# EAGLE design Framework (EAGLE 7.2.0)
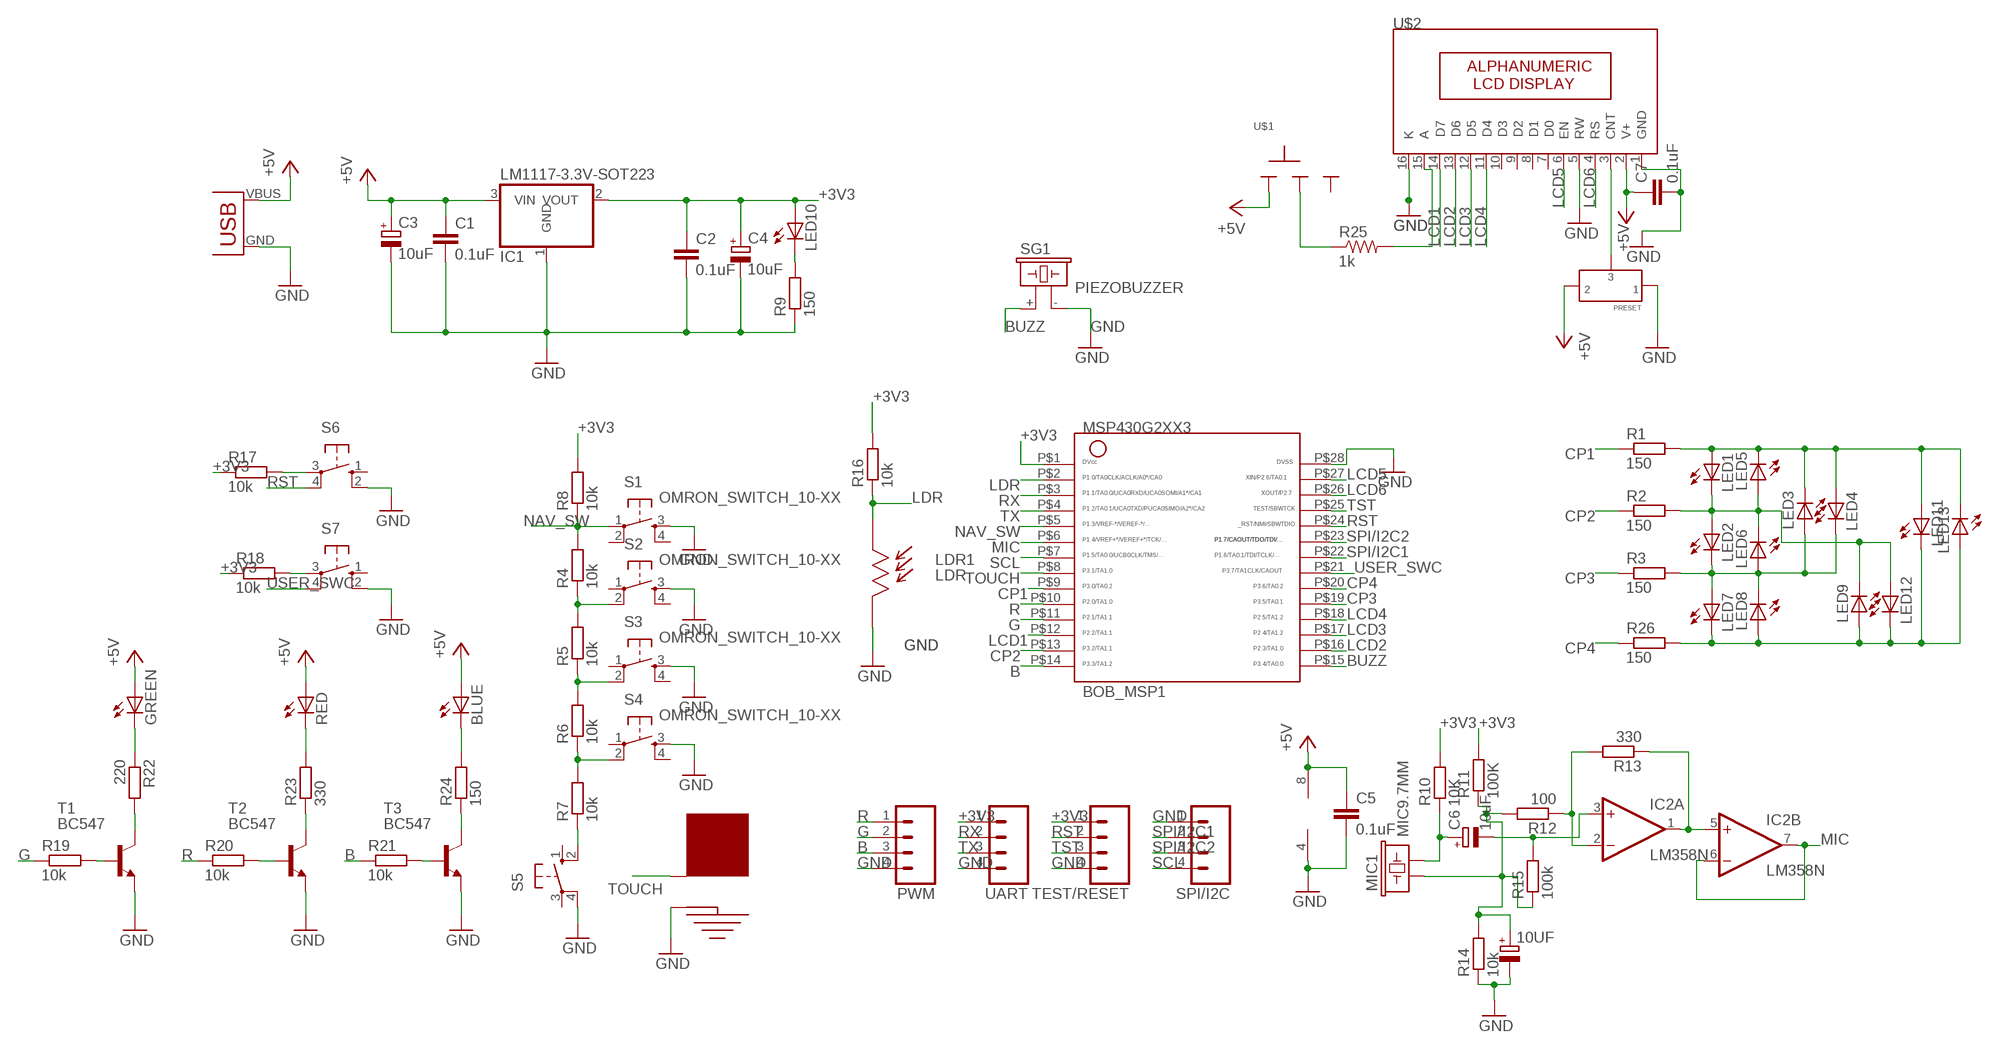
[diagram p0: schematic, sheet 1]

## Parts
10UF  CAPACITOR-ELECTROLYTICE2.5-6  [E2,5-6]
BLUE  LED-BLU-5MM  [LED-5MM]
BOB_MSP1  BOB_MSP_28PIN  [BOB_MSP_28PIN]
C1  0.1uF  CAPACITOR-CERAMIC025-025X050  [C025-025X050]
C2  0.1uF  CAPACITOR-CERAMIC025-025X050  [C025-025X050]
C3  10uF  CAPACITOR-ELECTROLYTICE2.5-6  [E2,5-6]
C4  10uF  CAPACITOR-ELECTROLYTICE2.5-6  [E2,5-6]
C5  0.1uF  CAPACITOR-CERAMIC025-025X050  [C025-025X050]
C6  10uF  CAPACITOR-ELECTROLYTICE2.5-6  [E2,5-6]
C7  0.1uF  CAPACITOR-CERAMIC025-025X050  [C025-025X050]
GREEN  LED-RED-5MM  [LED-5MM]
IC1  LM1117-3.3V-SOT223  [SOT223]
IC2  LM358N  [DIL08]
LDR1  LDR  [LDR-5MM]
LED1  LED-RED-3MM  [LED-3MM]
LED2  LED-RED-3MM  [LED-3MM]
LED3  LED-RED-3MM  [LED-3MM]
LED4  LED-RED-3MM  [LED-3MM]
LED5  LED-RED-3MM  [LED-3MM]
LED6  LED-RED-3MM  [LED-3MM]
LED7  LED-RED-3MM  [LED-3MM]
LED8  LED-RED-3MM  [LED-3MM]
LED9  LED-RED-3MM  [LED-3MM]
LED10  LED-RED-3MM  [LED-3MM]
LED11  LED-RED-3MM  [LED-3MM]
LED12  LED-RED-3MM  [LED-3MM]
LED13  LED-RED-3MM  [LED-3MM]
MIC1  MIC9.7MM  [MIC-9.7MM]
PWM  M04  [04P]
R1  150  RESISTOR-1/8W  [0204/7]
R2  150  RESISTOR-1/8W  [0204/7]
R3  150  RESISTOR-1/8W  [0204/7]
R4  10k  RESISTOR-1/8W  [0204/7]
R5  10k  RESISTOR-1/8W  [0204/7]
R6  10k  RESISTOR-1/8W  [0204/7]
R7  10k  RESISTOR-1/8W  [0204/7]
R8  10k  RESISTOR-1/8W  [0204/7]
R9  150  RESISTOR-1/8W  [0204/7]
R10  10K  RESISTOR-1/8W  [0204/7]
R11  100K  RESISTOR-1/8W  [0204/7]
R12  100  RESISTOR-1/8W  [0204/7]
R13  330  RESISTOR-1/8W  [0204/7]
R14  10k  RESISTOR-1/8W  [0204/7]
R15  100k  RESISTOR-1/8W  [0204/7]
R16  10k  RESISTOR-1/8W  [0204/7]
R17  10k  RESISTOR-1/8W  [0204/7]
R18  10k  RESISTOR-1/8W  [0204/7]
R19  10k  RESISTOR-1/8W  [0204/7]
R20  10k  RESISTOR-1/8W  [0204/7]
R21  10k  RESISTOR-1/8W  [0204/7]
R22  220  RESISTOR-1/8W  [0204/7]
R23  330  RESISTOR-1/8W  [0204/7]
R24  150  RESISTOR-1/8W  [0204/7]
R25  1k  RESISTOR0207/10  [0207/10]
R26  150  RESISTOR-1/8W  [0204/7]
RED  LED-GRN-5MM  [LED-5MM]
S1  OMRON_SWITCH_10-XX  [B3F-10XX]
S2  OMRON_SWITCH_10-XX  [B3F-10XX]
S3  OMRON_SWITCH_10-XX  [B3F-10XX]
S4  OMRON_SWITCH_10-XX  [B3F-10XX]
S5  PUSH-BUTTON-6MM  [B3F-10XX]
S6  10-XX  [B3F-10XX]
S7  10-XX  [B3F-10XX]
SG1  PIEZOBUZZER  [PIEZOBUZZER]
SPI/I2C  M04  [04P]
T1  BC547  [TO92]
T2  BC547  [TO92]
T3  BC547  [TO92]
TEST/RESET  M04  [04P]
TOUCH1  TOUCHPAD-20MM  [TOUCHPAD-20MM]
U$1  SLIDE-SWITCH-BIG  [SLIDE-SPDT-2.5X5-WITH-SUPPORT]
U$2  CHAR-LCD-16X2  [16X2-LCD-WITH-MOUNT]
U$3  USB-POWER  [MINI-USB-POWER]
U$4  PRESET  [PRESET-LR]
UART  M04  [04P]

## Nets
+3V3: BOB_MSP1.P$1 C2.1 C4.+ IC1.2(VOUT) LED10.A R8.2 R10.2 R11.2 R16.2 R17.1 R18.1 TEST/RESET.1 UART.1
B: BOB_MSP1.P$14 PWM.3 R21.1
BLUE: BLUE.K(C) R24.2
BUZZ: BOB_MSP1.P$15 SG1.+
CP1: BOB_MSP1.P$9 R1.1
CP2: BOB_MSP1.P$13 R2.1
CP3: BOB_MSP1.P$19 R3.1
CP4: BOB_MSP1.P$20 R26.1
G: BOB_MSP1.P$11 PWM.2 R19.1
GND: 10UF.- BOB_MSP1.P$28 C1.2 C2.2 C3.- C4.- C5.2 C7.2 IC1.1(GND) IC2.4(P:V-) LDR1.P$2 PWM.4 R9.1 R14.1 S1.3(S) S2.3(S) S3.3(S) S4.3(S) S5.4(P1) S6.2(S1) S7.2(S1) SG1.- SPI/I2C.1 T1.1(E) T2.1(E) T3.1(E) TEST/RESET.4 TOUCH1.GND U$2.1(GND) U$2.5(RW) U$2.16(K) U$3.GND U$4.P$1 UART.4
LCD1: BOB_MSP1.P$12 U$2.14(D7)
LCD2: BOB_MSP1.P$16 U$2.13(D6)
LCD3: BOB_MSP1.P$17 U$2.12(D5)
LCD4: BOB_MSP1.P$18 U$2.11(D4)
LCD5: BOB_MSP1.P$27 U$2.6(EN)
LCD6: BOB_MSP1.P$26 U$2.4(RS)
LDR: BOB_MSP1.P$2 LDR1.P$1 R16.1
MIC: BOB_MSP1.P$6 IC2.6(B:-IN) IC2.7(B:OUT)
N$1: LED1.A LED3.K(C) LED4.A LED5.K(C) LED11.A LED13.K(C) R1.2
N$2: LED1.K(C) LED2.A LED5.A LED6.K(C) LED9.K(C) LED12.A R2.2
N$3: LED2.K(C) LED3.A LED4.K(C) LED6.A LED7.A LED8.K(C) R3.2
N$4: R4.1 R5.2 S2.2(P1)
N$6: R18.2 S7.3(P)
N$7: R5.1 R6.2 S3.2(P1)
N$8: R6.1 R7.2 S4.2(P1)
N$9: R7.1 S5.2(S1)
N$12: C6.+ MIC1.2 R10.1
N$13: LED10.K(C) R9.2
N$14: C6.- IC2.3(A:+IN) R15.2
N$15: 10UF.+ MIC1.1 R11.1 R12.2 R14.2 R15.1
N$17: R24.1 T3.3(C)
N$18: IC2.2(A:-IN) R12.1 R13.2
N$19: IC2.1(A:OUT) IC2.5(B:+IN) R13.1
N$20: LED7.K(C) LED8.A LED9.A LED11.K(C) LED12.K(C) LED13.A R26.2
N$21: R17.2 S6.3(P)
N$22: R25.2 U$2.15(A)
N$23: R19.2 T1.2(B)
N$24: R22.2 T1.3(C)
N$25: GREEN.K(C) R22.1
N$26: R25.1 U$1.2
N$28: R23.2 RED.K(C)
N$29: R23.1 T2.3(C)
N$30: R20.2 T2.2(B)
N$33: R21.2 T3.2(B)
N$64: U$2.3(CNT) U$4.P$3
NAV_SW: BOB_MSP1.P$5 R4.2 R8.1 S1.1(P)
R: BOB_MSP1.P$10 PWM.1 R20.1
RST: BOB_MSP1.P$24 S6.4(P1) TEST/RESET.2
RX: BOB_MSP1.P$3 UART.2
SCL: BOB_MSP1.P$7 SPI/I2C.4
SPI/I2C1: BOB_MSP1.P$22 SPI/I2C.2
SPI/I2C2: BOB_MSP1.P$23 SPI/I2C.3
TOUCH: BOB_MSP1.P$8 TOUCH1.TOUCH
TST: BOB_MSP1.P$25 TEST/RESET.3
TX: BOB_MSP1.P$4 UART.3
USER_SWC: BOB_MSP1.P$21 S7.4(P1)
VCC: BLUE.A C1.1 C3.+ C5.1 C7.1 GREEN.A IC1.3(VIN) IC2.8(P:V+) RED.A U$1.1 U$2.2(V+) U$3.VBUS(VCC) U$4.P$2 ; supply symbol labelled +5V
Unconnected: S1.2(P1) S1.4(S1) S2.1(P) S2.4(S1) S3.1(P) S3.4(S1) S4.1(P) S4.4(S1) S5.1(S) S5.3(P) S6.1(S) S7.1(S) U$1.3 U$2.7(D0) U$2.8(D1) U$2.9(D2) U$2.10(D3)

## Library data of the parts
10UF C3 C4 C6 = modified_msp_framework_v3:CAPACITOR-ELECTROLYTIC: POLARIZED CAPACITOR, European symbol
BLUE GREEN RED = modified_msp_framework_v3:LED: Light Emitting Diode
BOB_MSP1 = modified_msp_framework_v3:BOB_MSP_28PIN
C1 C2 C5 C7 = modified_msp_framework_v3:CAPACITOR-CERAMIC: CAPACITOR, European symbol
IC1 = modified_msp_framework_v3:LM1117: LM1117 800mA Low Dropout (LDO) Positive Regulator 1.8V, 2.5V, 2.85V, 3.3V, 5V, and Adj Datasheet <www.ti.com/lit/ds/symlink/lm1117.pdf>; SUNROM: 4004
IC2 = modified_msp_framework_v3:LM358: OP AMP also LM158; LM258; LM2904 Source: http://cache.national.com/ds/LM/LM158.pdf
LDR1 = modified_msp_framework_v3:LDR: Light Dependent Resistor Sunrom Product Page <http://www.sunrom.com/p/ldr-5mm-light-dependent-resistor>; SUNROM: 3190
LED1-LED13 = modified_msp_framework_v3:LED: Light Emitting Diode; SUNROM: 3916
MIC1 = modified_msp_framework_v3:MIC: Microphone Omni-directional electret microphone. 9.7mm standard diameter.
PWM SPI/I2C TEST/RESET UART = modified_msp_framework_v3:M04: AMP QUICK CONNECTOR
R1-R24 R26 = modified_msp_framework_v3:RESISTOR: RESISTOR, European symbol
R25 = CEDT_JANUARY_2015_v5:RESISTOR
S1-S4 = CEDT_JANUARY_2015_v5:OMRON_SWITCH
S5 = modified_msp_framework_v3:PUSH-BUTTON: Tactile Switch Momentary Push to ON switch Omron B3F 10-xx & 40-xx Datasheet <http://www.omron.com/ecb/products/pdf/en-b3f.pdf>; SUNROM: 3951
S6 S7 = switch-omron:10-XX: OMRON SWITCH; MPN: B3F-1000; OC_FARNELL: 176432; OC_NEWARK: 36M3542
SG1 = modified_msp_framework_v3:PIEZOBUZZER: BUZZER Source: Buerklin; OC_FARNELL: unknown; OC_NEWARK: unknown
T1-T3 = modified_msp_framework_v3:BC547: NPN TRANSISTOR Datasheet <https://www.fairchildsemi.com/datasheets/BC/BC547.pdf>
TOUCH1 = modified_msp_framework_v3:TOUCHPAD
U$1 = modified_msp_framework_v3:SLIDE-SWITCH
U$2 = modified_msp_framework_v3:CHAR-LCD: Character LCD Character LCD based on HD44780 Controller Sunrom Product Page <http://www.sunrom.com/p/16x2-lcd-black-on-yellow>; SUNROM: 3013
U$3 = modified_msp_framework_v3:USB-POWER
U$4 = modified_msp_framework_v3:PRESET: Preset (Variable Resistor) Cermet rotary variable resistor Sunrom Product Page <http://www.sunrom.com/p/100k-cermet-preset>; SUNROM: 4553

## Board
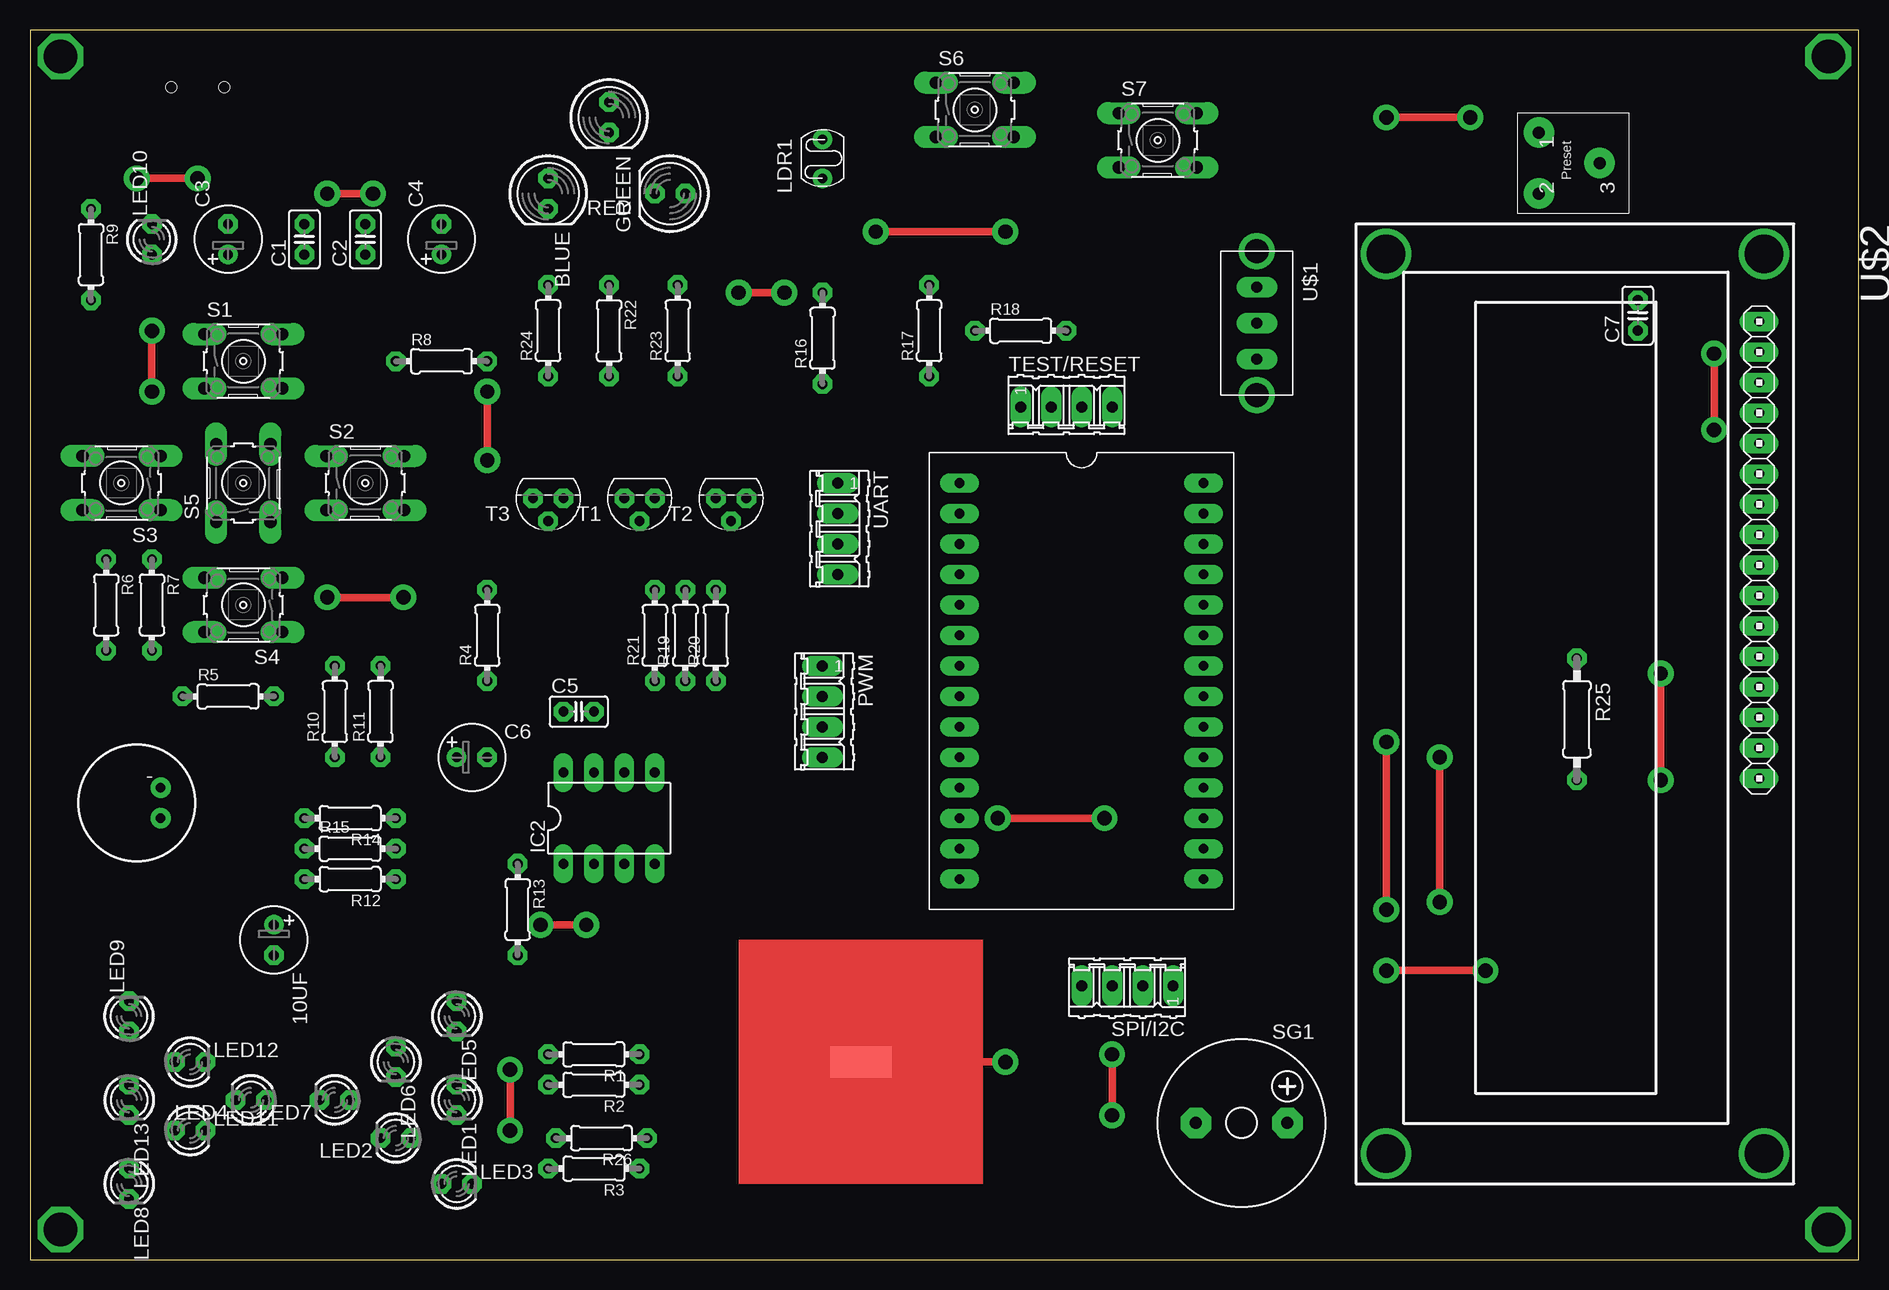
[diagram p1: board, top side]
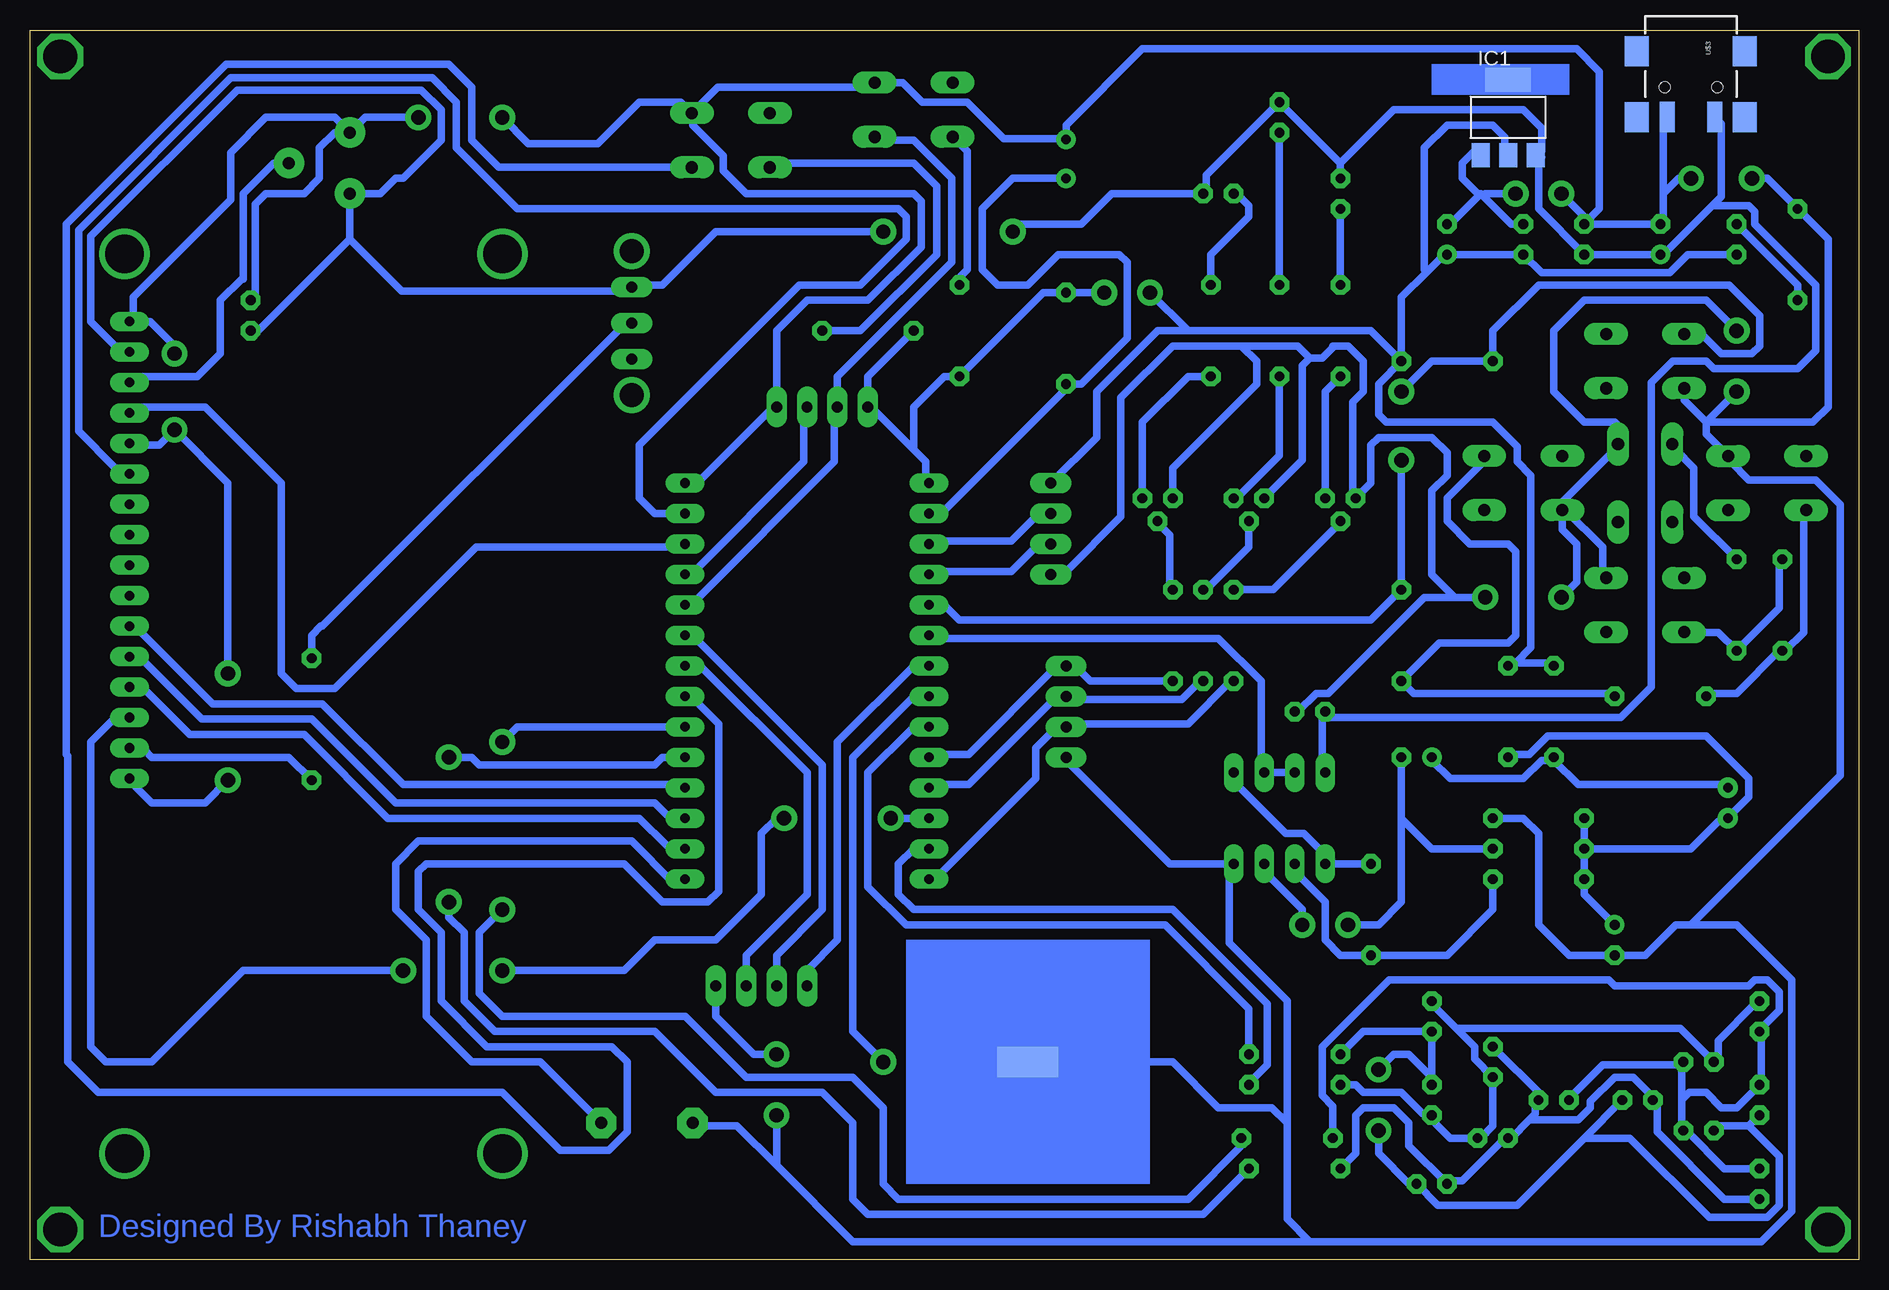
[diagram p2: board, bottom side, seen from below]

Size 152.38 x 102.54 mm. Coordinates in mm from the lower left corner, seen from the top.
Outline: 0,0 152.38,0 152.38,102.54 0,102.54 0,0
Copper layers (1*16): Top 0.035mm / dielectric 1.5mm / Bottom 0.035mm
Design rules "default *": minimum track width 24mil, minimum drill 24mil, track to track 16mil, track to pad 16mil, pad to pad 16mil, via to via 16mil, smd to smd 16mil, copper to edge 40mil, drill to drill 8mil, minimum pad ring 16mil, minimum via ring 16mil, stop-mask expansion 4mil, vias tented up to drill 0mil, thermal gap 10mil

### Footprints (pad centres in the part's own frame; a part is rotated, then mirrored left to right if it is on the bottom)
E2,5-6 = drill 0.813 pad 1.6: + -1.27,0 | drill 0.813 pad 1.6 octagon: - 1.27,0
LED-5MM = drill 0.813 octagon: A -1.27,0; K 1.27,0
BOB_MSP_28PIN = drill 0.8 long: P$1 2.54,2.54; P$2 5.08,2.54; P$3 7.62,2.54; P$4 10.16,2.54; P$5 12.7,2.54; P$6 15.24,2.54; P$7 17.78,2.54; P$8 20.32,2.54; P$9 22.86,2.54; P$10 25.4,2.54; P$11 27.94,2.54; P$12 30.48,2.54; P$13 33.02,2.54; P$14 35.56,2.54; P$15 35.56,22.86; P$16 33.02,22.86; P$17 30.48,22.86; P$18 27.94,22.86; P$19 25.4,22.86; P$20 22.86,22.86; P$21 20.32,22.86; P$22 17.78,22.86; P$23 15.24,22.86; P$24 12.7,22.86; P$25 10.16,22.86; P$26 7.62,22.86; P$27 5.08,22.86; P$28 2.54,22.86
C025-025X050 = drill 0.813 octagon: 1 -1.27,0; 2 1.27,0
SOT223 = smd 1.499 x 2.007: 1 -2.261,-3.15; 2 0.025,-3.15; 3 2.311,-3.15 | smd 3.81 x 2.007: 4 0,3.15
DIL08 = drill 0.813 long: 1 -3.81,-3.81; 2 -1.27,-3.81; 3 1.27,-3.81; 4 3.81,-3.81; 5 3.81,3.81; 6 1.27,3.81; 7 -1.27,3.81; 8 -3.81,3.81
LDR-5MM = drill 0.8: P$1 0,0; P$2 3.24,0
LED-3MM = drill 0.813 octagon: A -1.27,0; K 1.27,0
MIC-9.7MM = drill 0.8 pad 1.676: 1 -2,1.27; 2 -2,-1.27
04P = drill 0.914 long: 1 -3.81,0; 2 -1.27,0; 3 1.27,0; 4 3.81,0
0204/7 = drill 0.813 octagon: 1 -3.81,0; 2 3.81,0
0207/10 = drill 0.813 octagon: 1 -5.08,0; 2 5.08,0
B3F-10XX = drill 1.016 long: 1 -3.251,2.261; 2 3.251,2.261; 3 -3.251,-2.261; 4 3.251,-2.261
PIEZOBUZZER = drill 1.016 pad 2.54 octagon: + 3.81,0; - -3.81,0
TO92 = drill 0.813 octagon: 1 1.27,0; 2 0,1.905; 3 -1.27,0
TOUCHPAD-20MM = smd 5.08 x 2.54 bottom: GND 0,0 | smd 5.08 x 2.54: TOUCH 0,0
SLIDE-SPDT-2.5X5-WITH-SUPPORT = drill 0.9 long: 1 -3,0; 2 0,0; 3 3,0 | drill 2 pad 2.184: TAB1 -6,0; TAB2 6,0
16X2-LCD-WITH-MOUNT = drill 0.813 long: 1 8.12,33.608; 2 10.66,33.608; 3 13.2,33.608; 4 15.74,33.608; 5 18.28,33.608; 6 20.82,33.608; 7 23.36,33.608; 8 25.9,33.608; 9 28.44,33.608; 10 30.98,33.608; 11 33.52,33.608; 12 36.06,33.608; 13 38.6,33.608; 14 41.14,33.608; 15 43.68,33.608; 16 46.22,33.608 | drill 3.2: P$1 2.5,34; P$2 2.5,2.5; P$3 77.5,2.5; P$4 77.5,34
MINI-USB-POWER = smd 2.54 x 1.27: GND 2.5,-1.981; VBUS 2.5,1.981 | smd 2.5 x 2: GND@1 -3,-4.5; GND@2 -3,4.5; GND@3 2.5,4.5; GND@4 2.5,-4.5 | hole 0.9: 0,2.2; 0,-2.2
PRESET-LR = drill 1.016 pad 2.54: P$1 -2.54,-2.54; P$2 2.54,-2.54; P$3 0,2.54

### Placement (x,y rotation side)
10UF  20.32,26.67 270 top
BLUE  43.18,88.9 270 top
BOB_MSP1  74.93,67.31 270 top
C1  22.86,85.09 90 top
C2  27.94,85.09 90 top
C3  16.51,85.09 90 top
C4  34.29,85.09 90 top
C5  45.72,45.72 0 top
C6  36.83,41.91 0 top
C7  133.99,78.74 90 top
GREEN  48.26,95.25 270 top
IC1  29.21,95.25 0 bottom
IC2  48.26,36.83 0 top
LDR1  66.04,90.17 90 top
LED1  35.56,13.34 270 top
LED2  30.48,10.16 180 top
LED3  35.56,6.35 0 top
LED4  18.41,13.34 180 top
LED5  35.56,20.32 270 top
LED6  30.48,16.51 270 top
LED7  25.4,13.34 180 top
LED8  8.26,6.35 270 top
LED9  8.26,20.32 90 top
LED10  10.16,85.09 90 top
LED11  13.34,10.79 0 top
LED12  13.34,16.51 0 top
LED13  8.26,13.34 270 top
MIC1  8.89,38.1 180 top
PWM  66.04,45.72 270 top
R1  46.99,17.14 180 top
R2  46.99,14.61 180 top
R3  46.99,7.62 180 top
R4  38.1,52.07 90 top
R5  16.51,46.99 0 top
R6  6.35,54.61 270 top
R7  10.16,54.61 270 top
R8  34.29,74.93 0 top
R9  5.08,83.82 270 top
R10  25.4,45.72 90 top
R11  29.21,45.72 90 top
R12  26.67,31.75 180 top
R13  40.64,29.21 270 top
R14  26.67,36.83 180 top
R15  26.67,34.29 0 top
R16  66.04,76.83 90 top
R17  74.93,77.47 90 top
R18  82.55,77.47 0 top
R19  54.61,52.07 90 top
R20  57.15,52.07 90 top
R21  52.07,52.07 90 top
R22  48.26,77.47 270 top
R23  53.98,77.47 90 top
R24  43.18,77.47 90 top
R25  128.91,45.09 270 top
R26  47.62,10.16 180 top
RED  53.34,88.9 180 top
S1  17.78,74.93 0 top
S2  27.94,64.77 0 top
S3  7.62,64.77 180 top
S4  17.78,54.61 180 top
S5  17.78,64.77 90 top
S6  78.74,95.89 0 top
S7  93.98,93.34 0 top
SG1  100.97,11.43 0 top
SPI/I2C  91.44,22.86 180 top
T1  50.8,63.5 180 top
T2  58.42,63.5 180 top
T3  43.18,63.5 180 top
TEST/RESET  86.36,71.12 0 top
TOUCH1  69.22,16.51 0 top
U$1  102.23,78.11 270 top
U$2  110.49,86.36 270 top
U$3  13.97,97.79 270 bottom
U$4  128.27,91.44 270 top
UART  67.31,60.96 270 top

### Tracks (layer width: path | path; a pad name or v marks a point on that pad's centre or on a via)
+3V3  (via drill 1.19 pad 1.93)
  Top 0.61: v62.87,80.64 v59.05,80.64
  Bottom 0.61: LED10.A 14.22,83.82 15.75,82.3 26.42,82.3 C2.1 C4.+ 34.54,83.82 36.01,82.36 | UART.1 63.5,68.58 63.5,72.39 58.42,77.47 55.88,77.47 | 28.57,49.78 28.96,49.78 R11.2 28.45,49.78 | 28.57,49.78 28.45,49.78 | 28.45,49.78 25.4,49.78 R10.2 | IC1.2 29.46,92.46 29.46,93.6 30.48,94.61 34.29,94.61 36.2,92.71 36.2,82.55 36.01,82.36 | R8.2 38.1,80.26 36.01,82.36 | 78.74,67.56 82.3,71.12 TEST/RESET.1 82.55,73.66 R18.1 | 78.74,67.56 77.72,66.55 77.72,65.02 BOB_MSP1.P$1 | 38.1,74.68 R8.2 | R8.2 40.64,77.47 55.88,77.47 | 78.74,67.56 78.74,71.12 76.2,73.66 R17.1 67.94,80.64 R16.2 v62.87,80.64 | 28.57,49.78 27.3,51.05 27.3,65.41 28.45,66.55 28.45,67.82 30.48,69.85 39.37,69.85 40.01,70.48 40.01,73.03 R8.2 | v59.05,80.64 55.88,77.47
B
  Bottom 0.61: BOB_MSP1.P$14 77.22,32 76.71,32 68.58,40.13 68.58,42.67 67.06,44.2 66.04,44.2 PWM.3 66.04,44.7 55.88,44.7 52.32,48.26 R21.1
BLUE
  Bottom 0.61: R24.2 BLUE.K
BUZZ
  Bottom 0.61: BOB_MSP1.P$15 98.04,31.5 98.81,31.5 102.23,34.92 120.02,34.92 121.92,33.02 121.92,29.21 119.38,26.67 119.38,20.32 115.57,16.51 109.86,16.51 SG1.+ 104.65,11.68
CP1
  Bottom 0.61: BOB_MSP1.P$9 77.72,44.2 78.99,44.2 82.55,40.64 82.55,31.11 79.38,27.94 57.78,27.94 50.8,20.95 R1.1
CP2
  Bottom 0.61: R2.1 50.8,14.73 49.28,16.26 49.28,21.34 57.15,29.21 78.74,29.21 80.01,30.48 80.01,33.02 78.74,34.29 BOB_MSP1.P$13
CP3  (via drill 1.19 pad 1.93)
  Top 0.61: v117.47,41.91 v117.47,29.84
  Bottom 0.61: BOB_MSP1.P$19 99.69,41.91 100.33,41.27 114.94,41.27 115.57,41.91 v117.47,41.91 | R3.1 54.61,3.81 82.55,3.81 83.82,5.08 83.82,11.43 86.36,13.97 95.25,13.97 100.33,19.05 113.67,19.05 116.2,21.59 116.2,27.3 117.47,28.57 v117.47,29.84
CP4  (via drill 1.19 pad 1.93)
  Top 0.61: v113.03,43.18 v113.03,29.21
  Bottom 0.61: R26.1 51.44,9.53 55.88,5.08 80.01,5.08 81.28,6.35 81.28,12.7 83.82,15.24 92.71,15.24 97.79,20.32 113.03,20.32 114.94,22.23 114.94,27.3 v113.03,29.21 | BOB_MSP1.P$20 111.76,44.45 v113.03,43.18
G
  Bottom 0.61: 66.04,46.74 67.06,46.74 74.17,39.62 77.22,39.62 BOB_MSP1.P$11 | 66.04,46.74 56.39,46.74 54.86,48.26 R19.1 | 66.04,46.74 PWM.2
GND  (via drill 1.19 pad 1.93)
  Top 0.61: v113.03,95.25 v120.02,95.25 | v24.77,55.24 v31.11,55.24 | v8.89,90.17 v13.97,90.17 | v10.16,77.47 v10.16,72.39 | v140.34,75.56 v140.34,69.22 | v135.89,40.01 v135.89,48.9 | v24.77,88.9 v28.57,88.9 | v90.17,17.14 v90.17,12.06
  Bottom 0.61: PWM.4 66.04,41.66 57.4,33.02 52.83,33.02 52.45,32.64 | 90.17,7.87 83.82,1.52 45.72,1.52 | 90.17,7.87 93.47,11.18 97.03,11.18 SG1.- | 10.67,67.06 S3.3 | S3.3 10.67,66.55 9.14,65.02 3.56,65.02 1.52,62.99 1.52,40.39 13.97,27.94 | C5.2 46.74,45.72 45.21,47.24 44.2,47.24 36.2,55.24 33.66,55.24 | 45.72,75.18 44.7,75.18 43.81,76.07 43.81,76.2 42.55,76.2 41.27,74.93 41.27,72.39 42.16,71.5 42.16,63.5 T3.1 41.66,63.5 41.66,63.75 40.64,64.77 40.64,67.94 40.01,68.58 35.56,68.58 34.29,67.31 34.29,65.41 35.56,64.14 35.56,57.15 33.66,55.24 | UART.4 67.06,57.4 66.04,57.4 61.47,61.98 61.47,71.88 57.15,76.2 51.44,76.2 | S4.3 21.34,56.9 21.34,59.44 24.38,62.48 S2.3 | S2.3 24.89,62.99 20.32,67.56 S5.4 20.04,69.57 20.32,69.85 22.86,69.85 25.4,72.39 25.4,77.47 22.86,80.01 12.7,80.01 v10.16,77.47 | BOB_MSP1.P$28 97.54,65.02 96.52,65.02 90.42,71.12 TEST/RESET.4 90.17,77.47 87.63,80.01 82.55,80.01 78.11,84.45 78.11,88.27 78.74,88.9 92.71,88.9 94.61,90.81 94.61,92.08 97.16,94.61 97.16,95.53 S7.2 | 16.26,88.9 16.26,86.36 C3.- C1.2 | 16.26,88.9 16.26,93.98 U$3.GND | 66.04,93.47 LDR1.P$2 | 31.5,88.9 34.04,86.36 C4.- | 31.5,91.95 IC1.1 31.75,92.38 31.75,92.71 33.02,91.44 33.02,90.17 31.75,88.9 31.5,88.9 | C2.2 28.96,86.36 31.3,88.71 | 31.5,88.9 31.3,88.71 | C7.2 133.6,80.26 133.6,88.01 132.72,88.9 129.54,88.9 128.27,90.17 128.27,92.71 127,93.98 U$4.P$1 | T1.1 46.35,66.67 46.35,74.55 45.72,75.18 | 51.44,76.2 46.74,76.2 45.72,75.18 | T2.1 57.15,66.04 50.16,73.03 50.16,74.93 51.44,76.2 | v113.03,95.25 110.85,93.07 105.05,93.07 101.6,96.52 98.15,96.52 S7.2 | 66.04,93.47 71.25,93.47 74.3,96.52 78.03,96.52 79.65,98.15 S6.2 82.35,97.79 95.05,97.79 S7.2
  Bottom 0.61: S2.3 24.69,60.88 23.5,59.69 23.5,56.52 v24.77,55.24 | v31.11,55.24 33.66,55.24 | 12.7,69.85 14.53,71.68 S1.3 | 12.7,69.85 12.7,68.86 S3.3 | v8.89,90.17 7.62,90.17 R9.1 2.54,85.09 2.54,71.12 3.81,69.85 12.7,69.85 | v13.97,90.17 14.99,90.17 16.26,88.9 | v140.34,75.56 140.34,76.2 142.38,78.24 U$2.1 143.76,78.74 143.76,80.26 135.64,88.39 135.64,92.33 132.72,95.25 127,95.25 U$4.P$1 | U$2.5 143.96,67.94 141.6,67.94 v140.34,69.22 135.89,64.77 v135.89,48.9 | U$2.16 144.1,39.96 142.24,38.1 137.79,38.1 v135.89,40.01 | IC2.4 52.45,32.64 | C1.2 22.86,87 v24.77,88.9 | v28.57,88.9 31.11,88.9 31.3,88.71 | 47.62,11.43 47.62,21.59 52.45,26.42 52.45,32.64 | 47.62,11.43 47.62,3.43 45.72,1.52 | v90.17,12.06 90.17,7.87 | TOUCH1.GND 57.15,16.51 53.34,12.7 48.9,12.7 47.62,11.43 | v10.16,72.39 12.7,69.85 | v90.17,17.14 92.08,17.14 95.25,20.32 SPI/I2C.1 | 13.97,27.94 10.16,27.94 5.59,23.37 5.59,4.06 8.13,1.52 45.72,1.52 | 13.97,27.94 15.24,27.94 17.78,25.4 10UF.- 24.13,25.4 26.67,27.94 26.67,35.56 27.94,36.83 R14.1 | C1.2 21.59,87.63 21.59,99.06 23.5,100.97 59.69,100.97 66.04,94.61 66.04,93.47 | v120.02,95.25 124.46,95.25 U$4.P$1
LCD1  (via drill 1.19 pad 1.93)
  Top 0.61: v80.64,36.83 v89.53,36.83 | v113.03,24.13 v121.28,24.13
  Bottom 0.61: U$2.14 145.28,45.22 147.32,43.18 147.32,17.78 146.05,16.51 142.24,16.51 134.62,24.13 v121.28,24.13 | BOB_MSP1.P$12 v80.64,36.83 | v89.53,36.83 90.17,36.83 91.44,35.56 91.44,30.48 95.25,26.67 100.33,26.67 102.87,24.13 v113.03,24.13
LCD2
  Bottom 0.61: BOB_MSP1.P$16 98.04,34.54 99.31,34.54 101.6,36.83 122.56,36.83 129.54,43.81 139.06,43.81 143.01,47.76 U$2.13
LCD3
  Bottom 0.61: BOB_MSP1.P$17 98.04,37.08 99.31,37.08 100.33,38.1 121.92,38.1 128.91,45.09 138.05,45.09 143.76,50.8 U$2.12
LCD4
  Bottom 0.61: BOB_MSP1.P$18 98.04,39.62 121.28,39.62 128.02,46.35 137.16,46.35 143.76,52.96 143.76,53.34 U$2.11
LCD5
  Bottom 0.61: U$2.6 144.27,66.04 145.29,66.04 148.34,69.09 148.34,85.85 135.64,98.55 118.87,98.55 116.84,96.52 116.84,92.71 111.76,87.63 80.01,87.63 79.38,87 79.38,85.09 83.19,81.28 88.27,81.28 101.6,67.94 101.6,63.5 100.33,62.23 BOB_MSP1.P$27
LCD6
  Bottom 0.61: BOB_MSP1.P$26 98.04,59.44 115.19,59.44 127,47.62 130.18,47.62 131.44,48.9 131.44,64.77 137.79,71.12 143.6,71.12 U$2.4 143.76,71.12
LDR
  Bottom 0.61: 66.04,73.15 R16.1 | BOB_MSP1.P$2 77.22,62.48 76.2,62.48 66.04,72.64 R16.1 | R16.1 64.77,73.03 60.96,76.83 60.96,83.19 61.59,83.82 66.67,83.82 69.22,81.28 71.75,81.28 73.03,82.55 73.03,87.63 70.48,90.17 LDR1.P$1
MIC
  Bottom 0.61: BOB_MSP1.P$6 77.22,51.82 53.34,51.82 49.78,48.26 49.78,40.64 IC2.6 IC2.7
N$1  (via drill 1.19 pad 1.93)
  Top 0.61: v40.01,15.88 v40.01,10.79
  Bottom 0.61: 9.14,11.18 11.68,11.18 LED11.A | LED13.K 9.14,11.18 | 22.86,10.16 28.45,4.57 35.05,4.57 LED3.K 37.47,6.35 40.01,8.89 v40.01,10.79 | 22.86,10.16 LED4.A | 9.14,11.18 6.6,8.64 6.6,4.57 7.62,3.56 12.45,3.56 19.05,10.16 22.86,10.16 | 43.18,17.27 R1.2 41.27,19.05 LED5.K LED1.A 35.56,15.24 37.47,17.14 38.73,17.14 v40.01,15.88
N$2
  Bottom 0.61: LED9.K 8.64,21.34 11.68,18.29 11.68,16.76 LED12.A 14.86,19.3 33.53,19.3 | 33.53,19.3 32,17.78 32,16.76 LED6.K 30.48,11.18 31.5,10.16 LED2.A 34.04,10.16 35.56,11.68 LED1.K 35.56,12.19 36.32,12.19 38.1,13.97 41.27,13.97 41.91,14.61 R2.2 | 33.53,19.3 35.56,21.34 LED5.A
N$3
  Bottom 0.61: LED8.K 11.18,5.08 16.76,10.67 16.76,13.21 LED4.K 17.27,13.72 18.8,15.24 20.32,15.24 22.35,13.21 22.35,12.7 23.37,11.68 27.43,11.68 | 27.43,11.68 28.96,10.16 LED2.K 29.46,10.16 33.02,6.6 34.04,6.6 LED3.A 37.47,9.53 37.47,11.43 38.73,12.7 41.27,12.7 41.91,12.06 41.91,8.89 R3.2 | 27.43,11.68 26.92,12.19 26.92,13.21 LED7.A 26.42,13.72 LED6.A
N$4
  Bottom 0.61: R5.2 20.32,47.24 37.08,47.24 R4.1 34.92,51.44 29.21,51.44 28.57,52.07 28.57,59.05 29.21,59.69 32.38,59.69 34.29,61.59 34.29,63.5 31.5,66.29 31.5,66.55 S2.2
N$5  (via drill 2.79 pad 3.81)
  other vias: 149.86,100.33
N$6
  Bottom 0.61: R18.2 83.19,77.47 76.83,83.82 76.83,89.53 78.74,91.44 90.37,91.44 S7.3
N$7
  Bottom 0.61: R5.1 12.7,47.24 10.16,47.24 6.6,50.8 R6.2 6.1,50.8 4.57,52.32 4.57,62.48 S3.2
N$8
  Bottom 0.61: R6.1 6.6,58.42 6.6,54.36 R7.2 11.68,52.32 14.22,52.32 S4.2
N$9
  Bottom 0.61: R7.1 13.72,61.98 13.72,66.04 15.24,67.56 S5.2
N$10  (via drill 2.79 pad 3.81)
  other vias: 149.86,2.54
N$11  (via drill 2.79 pad 3.81)
  other vias: 2.54,2.54
N$12
  Bottom 0.61: 25.4,41.66 26.42,41.66 27.94,40.13 34.04,40.13 35.56,41.66 C6.+ | 25.4,41.66 23.37,39.62 11.18,39.62 MIC1.2 | 25.4,41.66 R10.1
N$13
  Bottom 0.61: R9.2 5.08,81.28 LED10.K
N$14  (via drill 1.19 pad 1.93)
  Top 0.61: v42.55,27.94 v46.35,27.94
  Bottom 0.61: 38.1,36.83 38.1,29.84 40.01,27.94 v42.55,27.94 | v46.35,27.94 46.35,29.21 49.53,32.38 IC2.3 | C6.- 38.1,36.83 | 38.1,36.83 35.56,34.29 R15.2
N$15
  Bottom 0.61: R11.1 28.96,42.16 27.43,42.16 25.91,43.69 12.7,43.69 9.14,40.13 9.14,38.61 10.67,37.08 MIC1.1 11.18,36.58 11.68,36.58 13.97,34.29 R15.1 | R14.2 R15.1 | R15.1 R12.2 22.86,30.48 10UF.+
N$16  (via drill 2.79 pad 3.81)
  other vias: 2.54,100.33
N$17
  Bottom 0.61: 44.7,63.5 T3.3 44.45,72.39 R24.1
N$18
  Bottom 0.61: R12.1 30.48,29.21 34.29,25.4 R13.2 43.18,25.4 44.45,26.67 44.45,29.84 46.99,32.38 IC2.2
N$19
  Bottom 0.61: 43.69,33.02 IC2.1 44.2,33.02 | 43.69,33.02 R13.1 | 43.69,33.02 46.23,35.56 47.75,35.56 51.82,39.62 51.82,40.64 IC2.5
N$20
  Bottom 0.61: LED8.A 11.18,7.62 14.22,10.67 LED11.K 14.73,11.18 14.73,13.34 | 14.73,13.34 14.73,16.26 | 14.73,16.26 21.34,16.26 23.88,13.72 LED7.K | 14.73,16.26 LED12.K | R26.2 43.81,12.83 44.7,13.72 44.7,17.78 39.12,23.37 20.83,23.37 20.32,22.86 9.14,22.86 8.64,23.37 7.62,23.37 6.6,22.35 6.6,20.83 8.13,19.3 LED9.A 8.13,18.8 8.13,14.73 LED13.A 10.16,12.7 11.43,12.7 12.7,13.97 14.1,13.97 14.73,13.34
N$21
  Bottom 0.61: 75.18,81.28 R17.2 74.93,81.92 74.3,82.55 74.3,92.43 S6.3
N$22
  Bottom 0.61: U$2.15 143.96,42.55 142.88,42.55 142.24,41.91 130.81,41.91 R25.2
N$23
  Bottom 0.61: T1.2 50.8,59.44 54.36,55.88 R19.2
N$24
  Bottom 0.61: R22.2 48.26,67.06 51.82,63.5 T1.3
N$25
  Bottom 0.61: GREEN.K R22.1
N$26
  Bottom 0.61: U$1.2 102.62,78.23 128.02,52.83 128.14,52.83 128.91,52.07 R25.1
N$28
  Bottom 0.61: RED.K 51.82,88.9 50.8,87.88 50.8,87 53.98,83.82 R23.2
N$29
  Bottom 0.61: 59.44,63.5 T2.3 59.69,69.85 55.88,73.66 R23.1
N$30
  Bottom 0.61: R20.2 57.4,55.88 57.4,60.45 58.42,61.47 T2.2
N$33
  Bottom 0.61: R21.2 48.77,55.88 43.18,61.47 T3.2
N$64
  Bottom 0.61: U$2.3 143.76,73.66 138.43,73.66 136.53,75.56 136.53,80.01 134.75,81.79 134.62,81.79 134.62,88.9 132.08,91.44 U$4.P$3
NAV_SW  (via drill 1.19 pad 1.93)
  Top 0.61: v38.1,66.67 v38.1,72.39
  Bottom 0.61: S1.1 13.06,77.19 11.43,75.56 8.89,75.56 8.26,76.2 8.26,78.74 10.79,81.28 26.67,81.28 30.48,77.47 R8.1 35.56,74.93 v38.1,72.39 | v38.1,66.67 R4.2 40.64,53.34 74.93,53.34 76.2,54.61 BOB_MSP1.P$5
R
  Bottom 0.61: 66.04,49.28 67.06,49.28 74.17,42.16 77.22,42.16 BOB_MSP1.P$10 | R20.1 64.01,48.26 65.02,49.28 66.04,49.28 | 66.04,49.28 PWM.1
RST
  Bottom 0.61: BOB_MSP1.P$24 97.54,54.86 97.03,54.86 85.34,66.55 85.34,71.12 TEST/RESET.2 | 84.84,71.12 TEST/RESET.2 | TEST/RESET.2 85.09,73.66 75.56,83.19 75.56,90.17 78.74,93.34 81.71,93.34 S6.4
RX
  Bottom 0.61: BOB_MSP1.P$3 77.22,59.94 70.61,59.94 68.58,61.98 67.56,61.98 UART.2
SCL
  Bottom 0.61: BOB_MSP1.P$7 78.74,49.53 85.09,43.18 85.09,26.67 87.63,24.13 SPI/I2C.4
SPI/I2C1
  Bottom 0.61: BOB_MSP1.P$22 96.52,49.53 87.63,40.64 87.63,30.48 92.71,25.4 SPI/I2C.2
SPI/I2C2
  Bottom 0.61: BOB_MSP1.P$23 97.54,51.82 96.9,51.82 86.36,41.27 86.36,29.21 90.17,25.4 SPI/I2C.3
TOUCH  (via drill 1.19 pad 1.93)
  Top 0.61: TOUCH1.TOUCH v81.28,16.51
  Bottom 0.61: BOB_MSP1.P$8 78.74,46.99 83.82,41.91 83.82,19.05 v81.28,16.51
TST
  Bottom 0.61: BOB_MSP1.P$25 97.54,57.4 97.03,57.4 87.88,66.55 87.88,71.12 TEST/RESET.3
TX
  Bottom 0.61: BOB_MSP1.P$4 77.22,57.4 70.61,57.4 68.58,59.44 67.56,59.44 UART.3
USER_SWC
  Bottom 0.61: BOB_MSP1.P$21 97.54,46.74 97.03,46.74 95,44.7 95,30.73 95.89,29.84 99.69,29.84 102.87,33.02 119.38,33.02 120.02,32.38 120.02,29.21 118.11,27.3 118.11,21.59 114.3,17.78 103.89,17.78 102.62,16.51 102.62,10.67 104.14,9.14 108.2,9.14 113.03,13.97 146.69,13.97 149.22,16.51 149.22,42.04 149.35,42.16 149.35,86.36 136.02,99.69 117.47,99.69 115.57,97.79 115.57,93.34 113.31,91.08 S7.4
VCC  (via drill 1.19 pad 1.93)
  Top 0.61: v70.48,85.72 v81.28,85.72
  Bottom 0.61: 43.18,91.44 BLUE.A | 43.18,91.44 GREEN.A 54.36,90.42 54.36,88.9 RED.A 62.23,88.9 64.77,86.36 69.85,86.36 v70.48,85.72 | 26.42,91.95 IC1.3 | IC2.8 44.7,40.64 44.7,45.72 C5.1 43.94,45.21 19.81,45.21 17.27,47.75 17.27,73.15 15.49,74.93 12.7,74.93 12.06,74.3 5.08,74.3 3.56,75.82 3.56,81.28 8.64,86.36 8.64,87.38 9.14,87.88 12.19,87.88 | 12.19,87.88 16.26,83.82 C3.+ C1.1 26.67,87.63 26.67,91.87 IC1.3 | IC1.3 26.42,92.46 26.42,94.36 27.94,95.89 38.73,95.89 43.18,91.44 | 133.6,77.72 C7.1 133.35,77.47 125.73,85.09 | U$2.2 144.27,76.2 145.29,76.2 147.32,78.23 147.32,85.34 135.13,97.54 119.76,97.54 118.11,95.89 118.11,93.34 121.28,90.17 121.92,90.17 123.19,88.9 U$4.P$2 125.73,85.09 | 125.73,85.09 121.41,80.77 102.62,80.77 U$1.1 102.06,81.28 99.69,81.28 95.25,85.72 v81.28,85.72 | 12.19,87.88 11.43,88.65 11.43,94.73 U$3.VBUS
(copper drawn outside any net)
  shapes: Bottom area x1

### Text on the board
Bottom: Designed By Rishabh Thaney